# EAGLE design rapidshark-pmos-quarter-bridge-mk-1.0 (EAGLE 6.5.0)
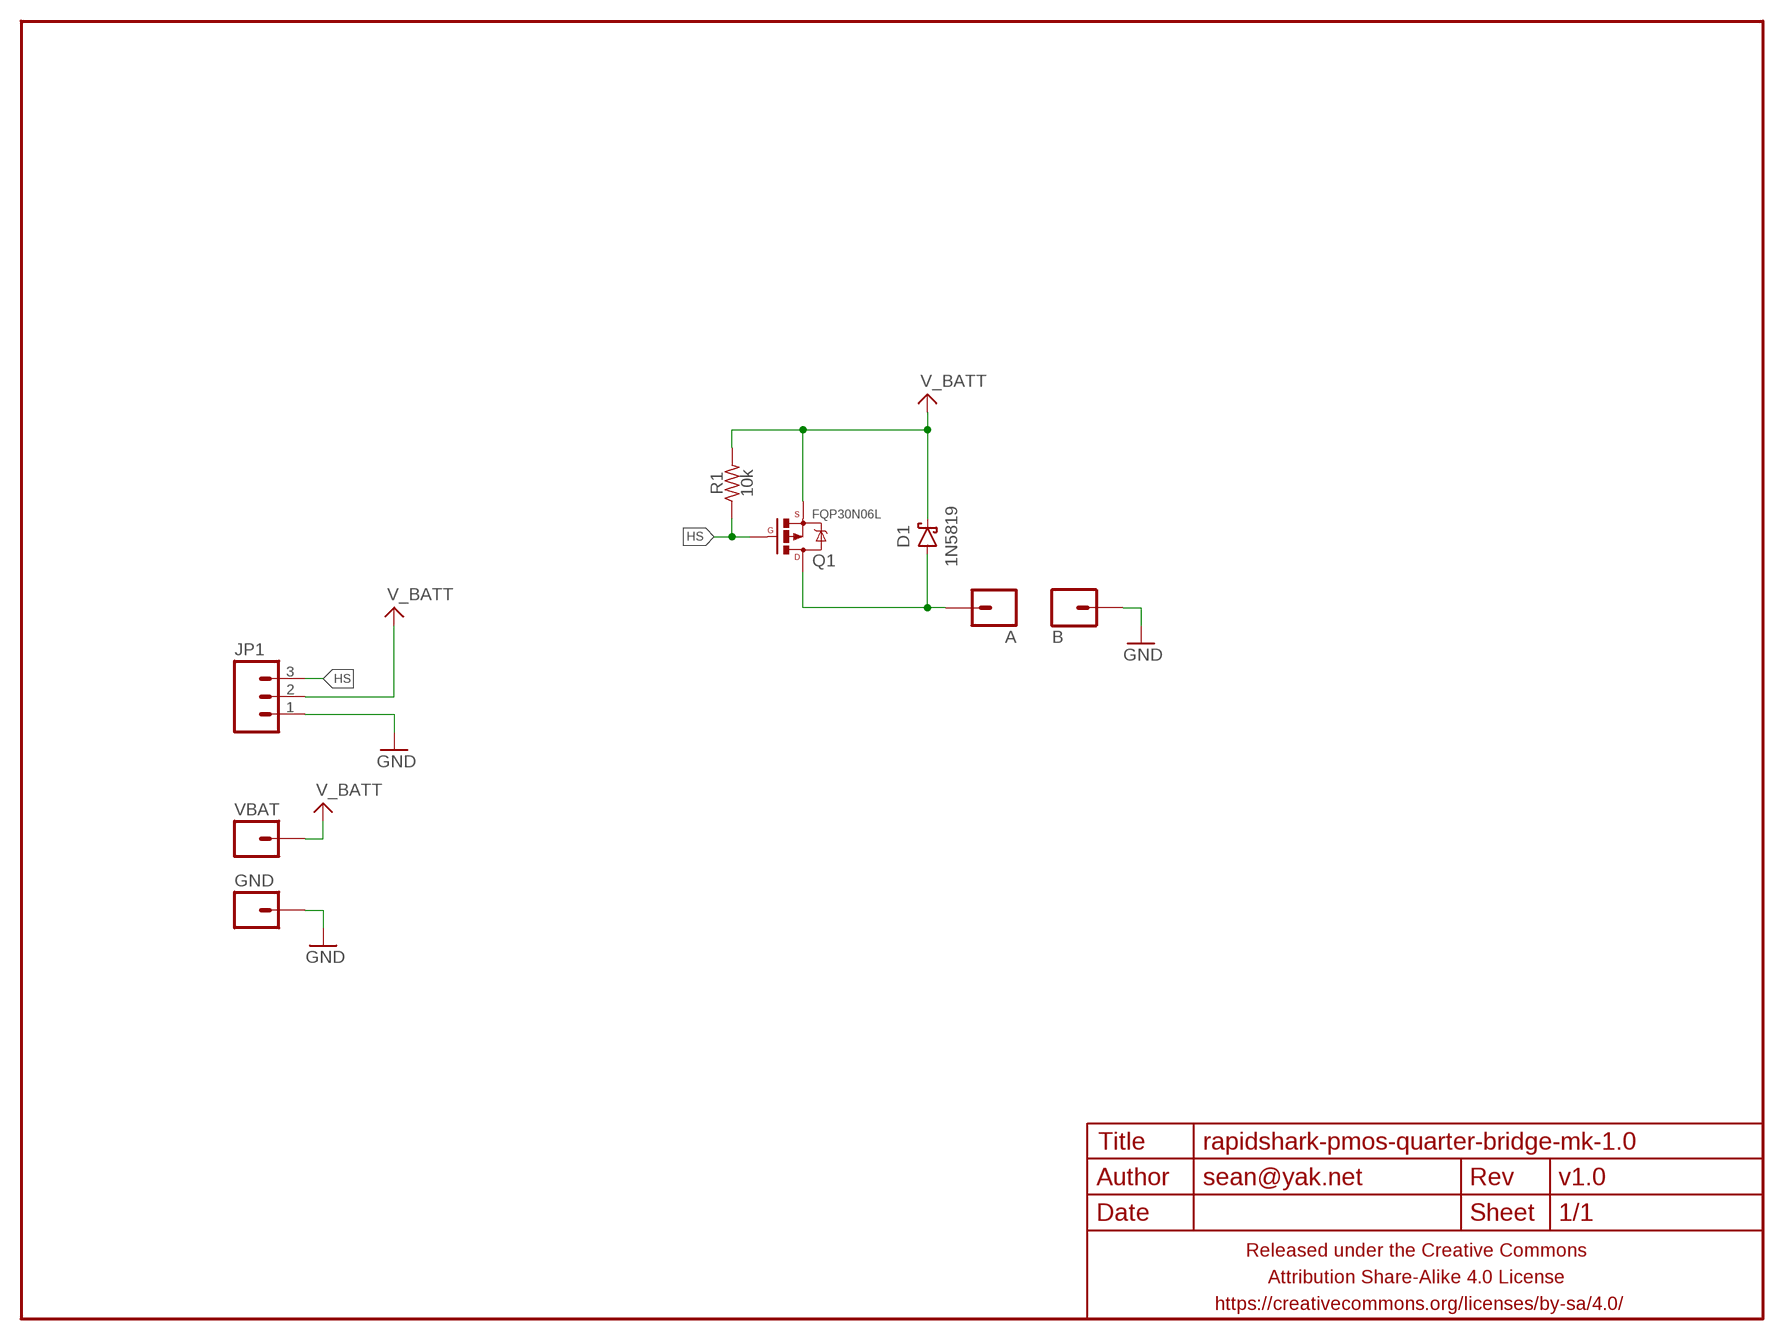
[diagram p0: schematic, sheet 1]

## Parts
A  M0112AWG  [1X01-12AWG]
B  M0112AWG  [1X01-12AWG]
D1  1N5819  DIODE-SCHOTTKYPTH-10.16MM  [DIODE-SCHOTTKY-10.16MM]
FRAME1  FRAME-LETTERNO_PACKAGE  [DUMMY]
GND  M0112AWG  [1X01-12AWG]
JP1  M03PTH-CENTERED  [1X03-CENTERED]
Q1  FQP30N06L  MOSFET-PCHANNELTO-220-THERMPAD-TABONLY  [TO220-THERMPAD]
R1  10k  RESISTORPTH-AXIAL-5.08MM  [RESISTOR-AXIAL-PTH-5.08MM]
VBAT  M0112AWG  [1X01-12AWG]

## Nets
A: A.1 D1.A Q1.2@1(D)
GND: B.1 GND.1 JP1.1
HS: JP1.3 Q1.1(G) R1.P$1
V_BATT: D1.C JP1.2 Q1.3(S) R1.P$2 VBAT.1

## Library data of the parts
A B GND VBAT = A_butts:M01: Header 1 Standard 1-pin 0.1" header. Use with straight break away headers (SKU : PRT-00116), right angle break away headers (PRT-00553), swiss pins (PRT-00743), machine pins (PRT-00117), and female headers (PRT-00115).
D1 = A_butts:DIODE-SCHOTTKY: Schottky diodes in SFE's production catalog BAT20J 1A 23V 0.62Vf RB751 120mA 40V 0.37Vf PMEG4005EJ 0.5A 40V 0.42Vf MBRA140 1A 40V 0.5Vf B340A 3A 40V SMA
FRAME1 = A_butts:FRAME-LETTER: Schematic Frame Standard 8.5x11 US Letter frame; DESIGNER: sean@yak.net; VERSION: v1.0
JP1 = a_parts:M03: Header 3 Standard 3-pin 0.1" header. Use with straight break away headers (SKU : PRT-00116), right angle break away headers (PRT-00553), swiss pins (PRT-00743), machine pins (PRT-00117), and female headers (PRT-00115). Molex polarized connector foot print use with SKU : PRT-08232 with associated crimp pins and housings.
Q1 = A_butts:MOSFET-PCHANNEL: Generic PMOSFET IRLML2244 - TRANS-11153 (SOT-23 -20V -4.3A) (1.Gate 2.Source 3.Drain) FQP27P06 - COM-10349 <http://www.sparkfun.com/products/10349> (TO-220 -60V -27A) (1.Gate 2.Source 3.Drain)
R1 = a_parts:RESISTOR: RESISTOR, American symbol

## Board
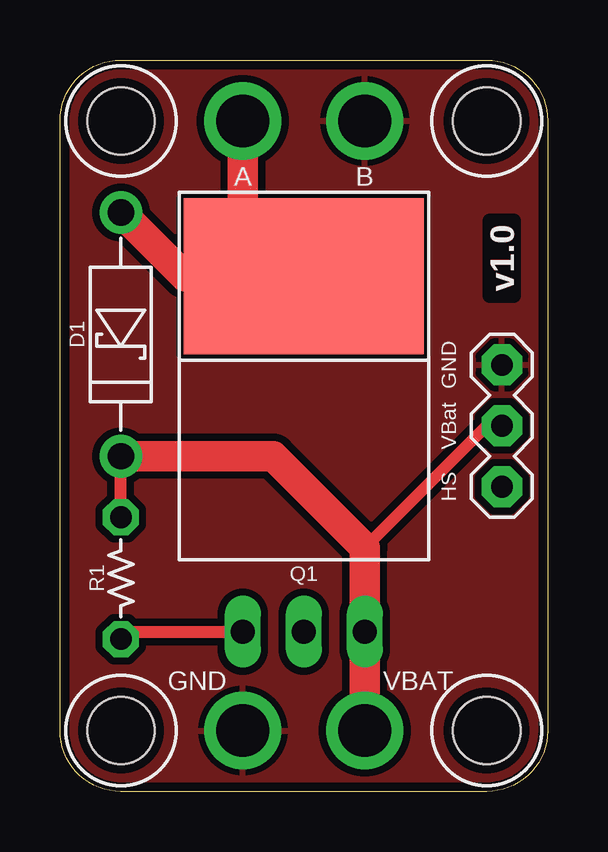
[diagram p1: board, top side]
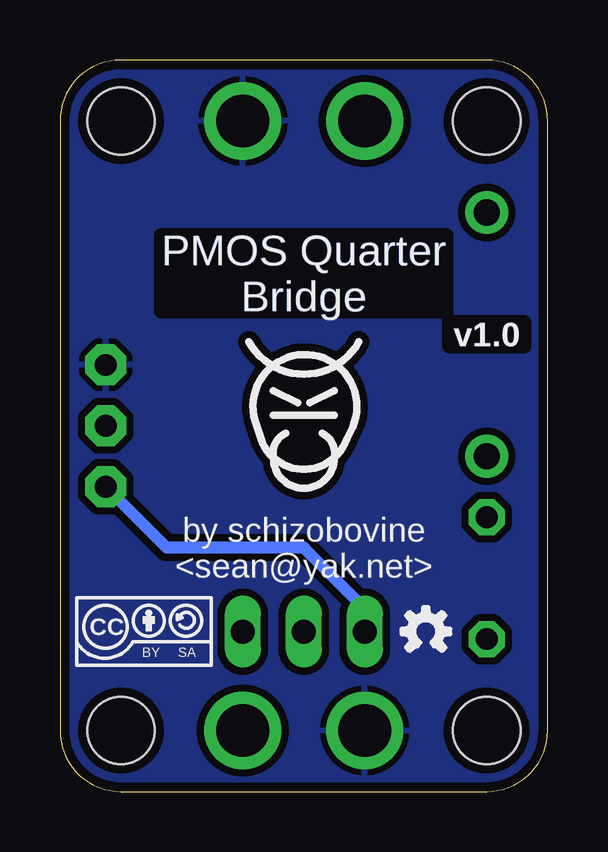
[diagram p2: board, bottom side, seen from below]

Size 20.32 x 30.48 mm. Coordinates in mm from the lower left corner, seen from the top.
Outline: 20.32,27.94 20.32,2.54 arc-90 17.78,0 2.54,0 arc-90 0,2.54 0,27.94 arc-90 2.54,30.48 17.78,30.48 arc-90 20.32,27.94
Copper layers (1*16): Top 0.0356mm / dielectric 1.5011mm / Bottom 0.0356mm
Design rules "LaenPCBOrder_2": minimum track width 6mil, minimum drill 13mil, track to track 6mil, track to pad 6mil, pad to pad 6mil, via to via 6mil, smd to smd 6mil, copper to edge 15mil, drill to drill 6mil, minimum pad ring 7mil, minimum via ring 7mil, stop-mask expansion 3mil, vias tented up to drill 20mil, thermal gap 10mil
Holes 2.8 mm at 2.54,2.54 17.78,2.54 17.78,27.94 2.54,27.94

### Footprints (pad centres in the part's own frame; a part is rotated, then mirrored left to right if it is on the bottom)
1X01-12AWG = drill 2.2 pad 3.2: 1 0,0
DIODE-SCHOTTKY-10.16MM = drill 1.1 pad 1.778: A -5.08,0; C 5.08,0
1X03-CENTERED = drill 0.9 pad 1.7 octagon: 1 -2.54,0; 2 0,0; 3 2.54,0
TO220-THERMPAD = drill 1 long: 1 -2.54,0; 2@2 0,0; 3 2.54,0 | smd 10 x 6.5: 2@1 0,14.81
RESISTOR-AXIAL-PTH-5.08MM = drill 0.9 pad 1.5 octagon: P$1 -2.54,0; P$2 2.54,0

### Placement (x,y rotation side)
A  7.62,27.94 180 top
B  12.7,27.94 180 top
D1  2.54,19.05 270 top
FRAME1  0,0 0 bottom
GND  7.62,2.54 180 top
JP1  18.41,15.24 270 top
Q1  10.16,6.67 0 top
R1  2.54,8.89 90 top
U$1  [COW_SMALL_METAL_NOTEXT]  10.16,16.19 0 bottom
U$2  [CC-BY-SA-4.0-NO-URL]  16.83,6.67 0 bottom
U$3  [OSHWLOGO_TINY_SILKONLY]  5.08,6.67 0 bottom
VBAT  12.7,2.54 180 top

### Tracks (layer width: path | path; a pad name or v marks a point on that pad's centre or on a via)
A
  Top 1.27: D1.A 5.19,21.48 Q1.2@1 7.62,24.02 A.1
GND
  pour Top (isolate 0.305, rank 5): 2.54,30.48 17.78,30.48 arc-90 20.32,27.94 20.32,2.54 arc-90 17.78,0 2.54,0 arc-90 0,2.54 0,27.94 arc-90
  pour Bottom (isolate 0.305, rank 5): 17.78,0 2.54,0 arc-90 0,2.54 0,27.94 arc-90 2.54,30.48 17.78,30.48 arc-90 20.32,27.94 20.32,2.54 arc-90
HS
  Top 0.508: R1.P$1 2.86,6.67 Q1.1
  Bottom 0.508: Q1.1 7.62,7.62 10.16,10.16 15.88,10.16 JP1.3
V_BATT
  Top 0.508: R1.P$2 D1.C | JP1.2 17.78,15.24 12.7,10.16
  Top 1.27: VBAT.1 Q1.3 12.7,10.16 8.89,13.97 D1.C

### Text on the board
Top: v1.0
Bottom: PMOS Quarter / Bridge | v1.0
tPlace: v1.0 | GND | VBat | HS
bPlace: PMOS Quarter / Bridge | v1.0 | by schizobovine / <sean@yak.net>